# Altium schematic sheet NVME.SchDoc
size C; SheetNumber: 6; SheetTotal: 17
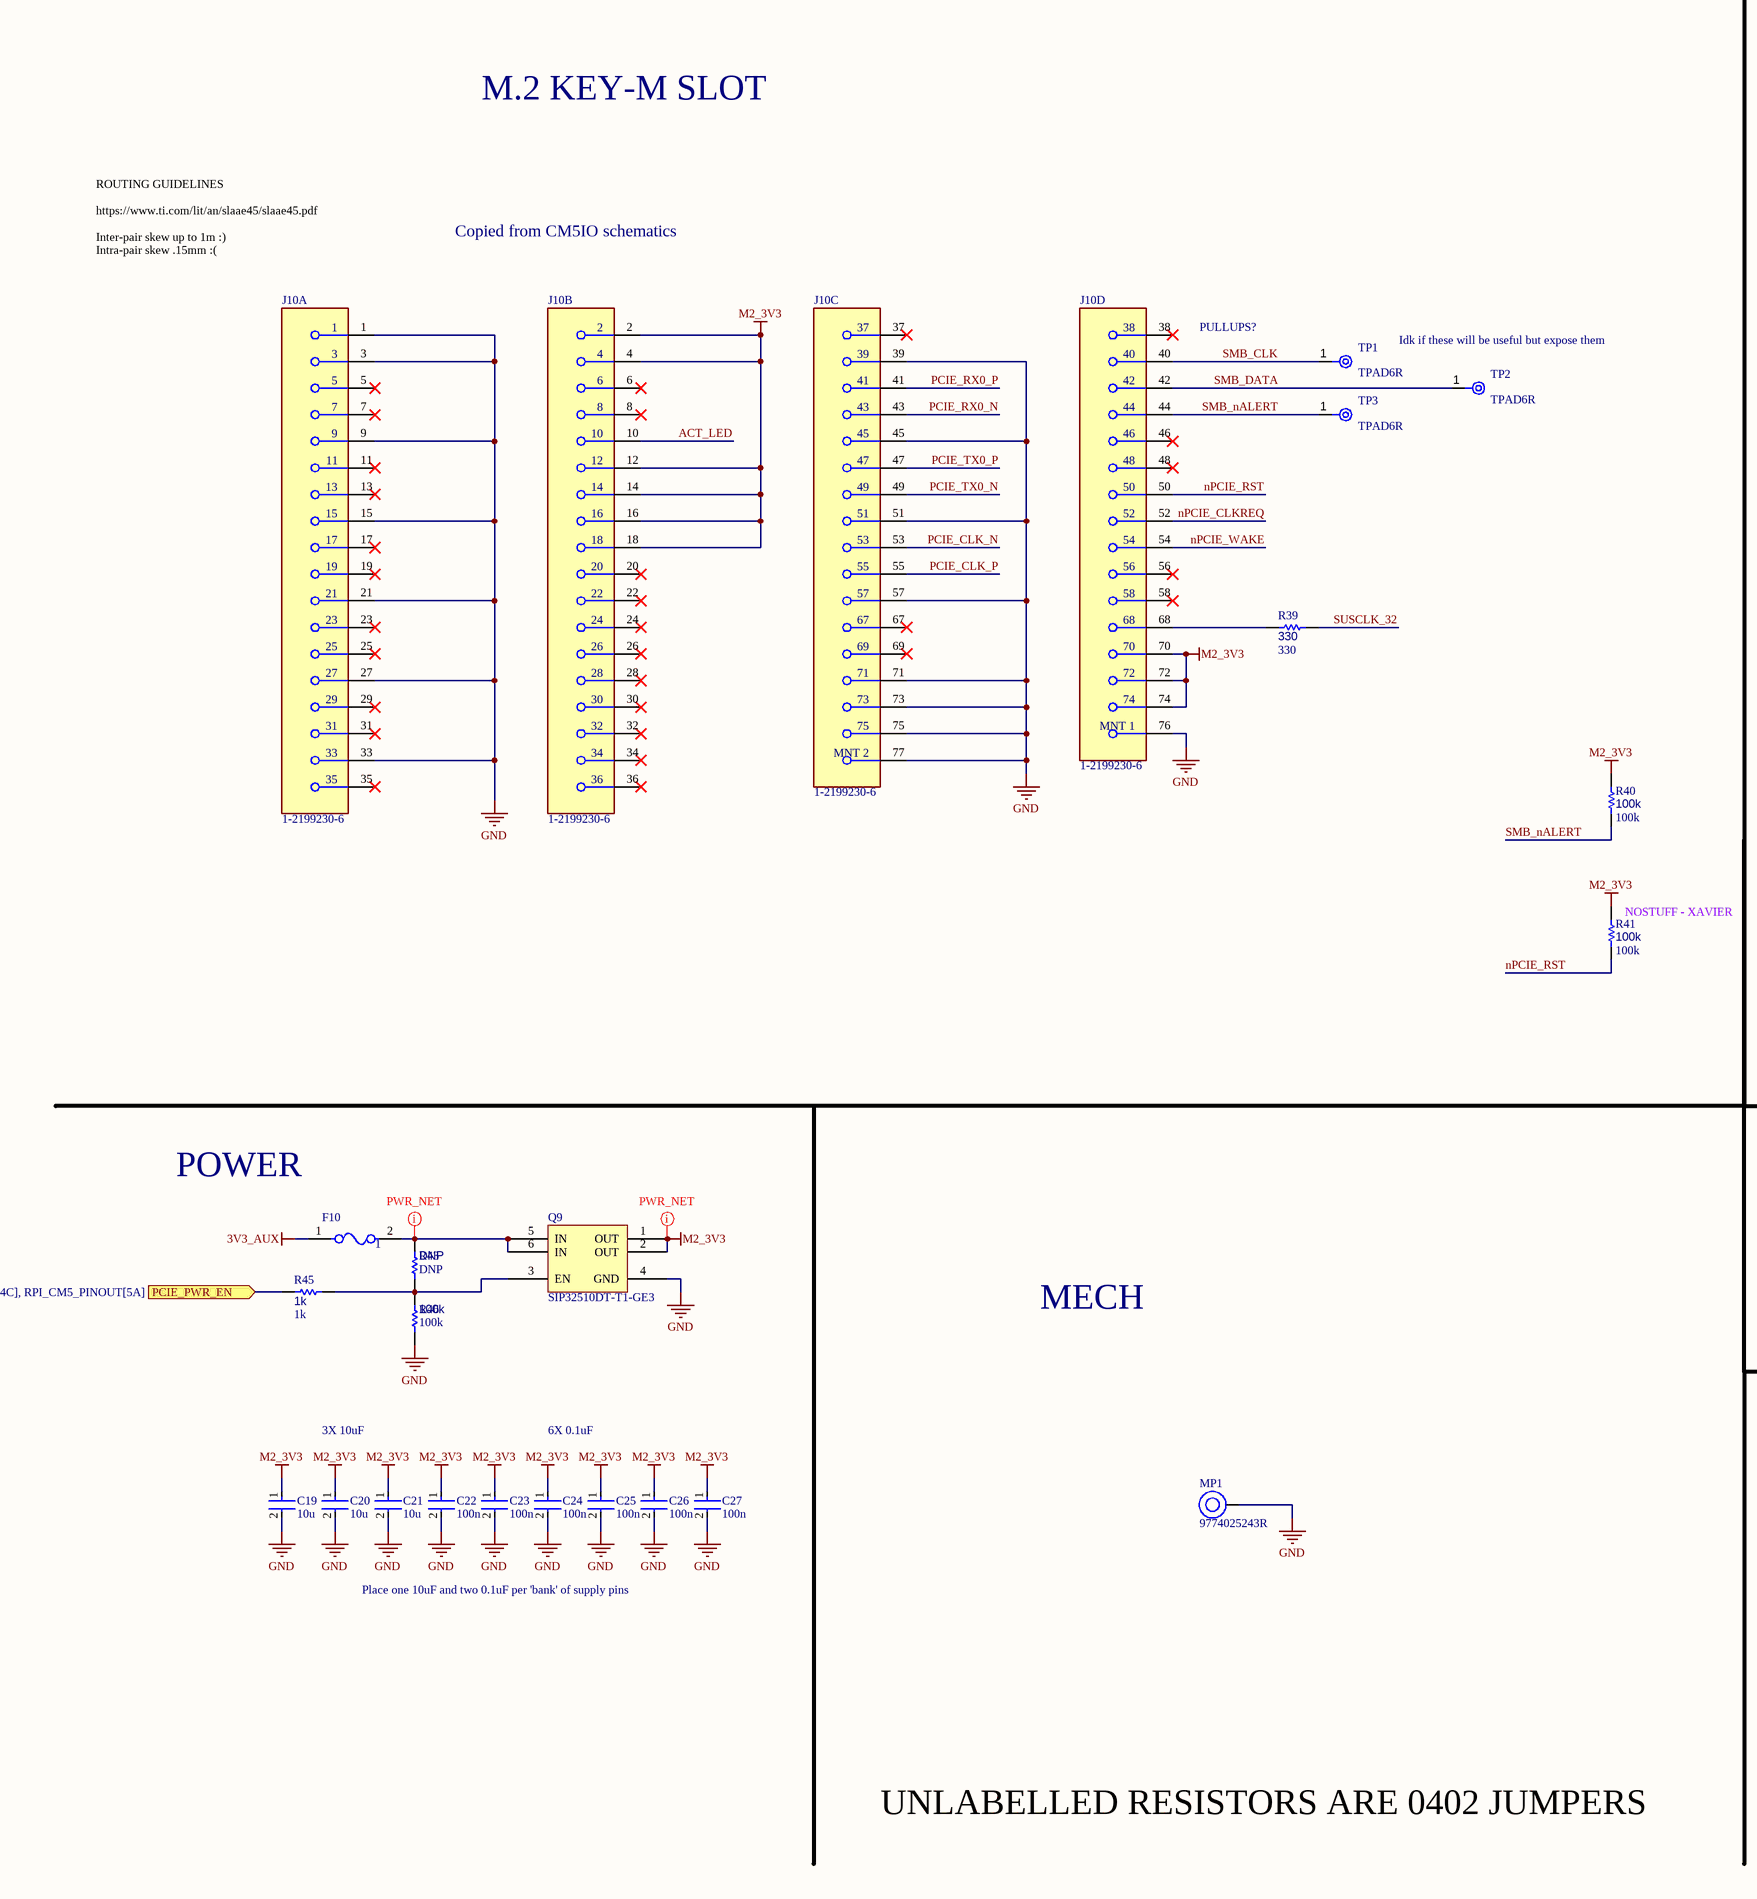
[diagram p0: NVME.SchDoc, left]
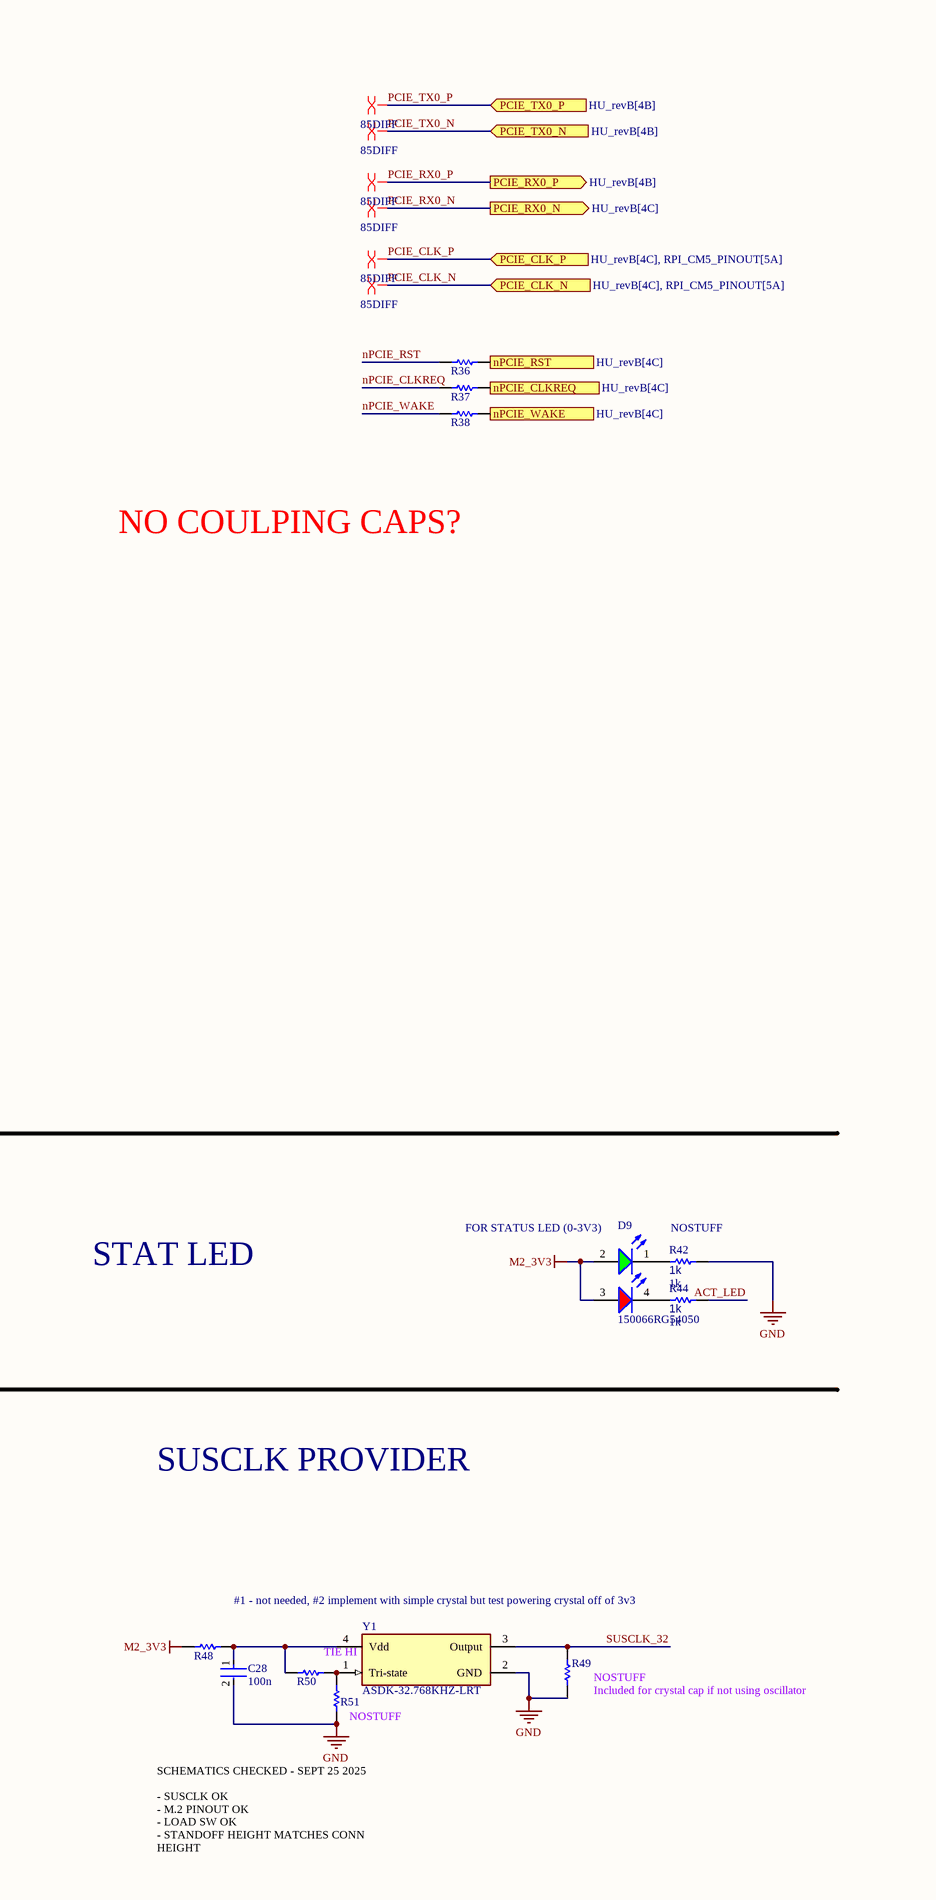
[diagram p1: NVME.SchDoc, right]

## Parts
C19  10u  [FP-0402-L_1_0_0_05-W_0_5-IPC_A]
C20  10u  [FP-0402-L_1_0_0_05-W_0_5-IPC_A]
C21  10u  [FP-0402-L_1_0_0_05-W_0_5-IPC_A]
C22  100n  [FP-0402-L_1_0_0_05-W_0_5-IPC_A]
C23  100n  [FP-0402-L_1_0_0_05-W_0_5-IPC_A]
C24  100n  [FP-0402-L_1_0_0_05-W_0_5-IPC_A]
C25  100n  [FP-0402-L_1_0_0_05-W_0_5-IPC_A]
C26  100n  [FP-0402-L_1_0_0_05-W_0_5-IPC_A]
C27  100n  [FP-0402-L_1_0_0_05-W_0_5-IPC_A]
C28  100n  [FP-0402-L_1_0_0_05-W_0_5-IPC_A]
D9  150066RG54050  [WL-SBCD_0606]
F10  1  [FP-0685T-MFG]
J10  1-2199230-6  [FP-1-2199230-6-MFG]  (parts A,B,C,D of 4)
MP1  9774025243R  [9774025243]
Q9  SIP32510DT-T1-GE3  [SOT95P284X110-6N]
R36  0402 JUMPER  [RESC1005X40X25ML05T05]  (value not drawn)
R37  0402 JUMPER  [RESC1005X40X25ML05T05]  (value not drawn)
R38  0402 JUMPER  [RESC1005X40X25ML05T05]  (value not drawn)
R39  330  [R0603B]
R40  100k  [R0603B]
R41  100k  [R0603B]
R42  1k  [R0603B]
R43  DNP  [R0603B]
R44  1k  [R0603B]
R45  1k  [R0603B]
R46  100k  [R0603B]
R48  0402 JUMPER  [RESC1005X40X25ML05T05]  (value not drawn)
R49  0402 JUMPER  [RESC1005X40X25ML05T05]  (value not drawn)
R50  0402 JUMPER  [RESC1005X40X25ML05T05]  (value not drawn)
R51  0402 JUMPER  [RESC1005X40X25ML05T05]  (value not drawn)
TP1  TPAD6R  [New footprint 1]
TP2  TPAD6R  [New footprint 1]
TP3  TPAD6R  [New footprint 1]
Y1  ASDK-32.768KHZ-LRT  [FP-ASDK-MFG]

## Ports
nPCIE_CLKREQ (out, see HU_revB[4C]), nPCIE_RST (in, see HU_revB[4C]), nPCIE_WAKE (out, see HU_revB[4C]), PCIE_CLK_N (in, see HU_revB[4C], RPI_CM5_PINOUT[5A]), PCIE_CLK_P (in, see HU_revB[4C], RPI_CM5_PINOUT[5A]), PCIE_PWR_EN (in, see HU_revB[4C], RPI_CM5_PINOUT[5A]), PCIE_RX0_N (out, see HU_revB[4C]), PCIE_RX0_P (out, see HU_revB[4B]), PCIE_TX0_N (in, see HU_revB[4B]), PCIE_TX0_P (in, see HU_revB[4B])

## Nets
3V3_AUX: F10.1
GND: C19.2 C20.2 C21.2 C22.2 C23.2 C24.2 C25.2 C26.2 C27.2 C28.2 J10.1 J10.3 J10.9 J10.15 J10.21 J10.27 J10.33 J10.39 J10.45 J10.51 J10.57 J10.71 J10.73 J10.75 J10.76(MNT_1) J10.77(MNT_2) MP1.1 Q9.4(GND) R42.2 R46.1 R49.1 R51.1 Y1.2(GND)
M2_3V3: C19.1 C20.1 C21.1 C22.1 C23.1 C24.1 C25.1 C26.1 C27.1 D9.2(A) D9.3(A) J10.2 J10.4 J10.12 J10.14 J10.16 J10.18 J10.70 J10.72 J10.74 Q9.1(OUT) Q9.2(OUT) R40.1 R41.1 R48.1
ACT_LED: J10.10 R44.2
nPCIE_CLKREQ: J10.52 R37.1
nPCIE_CLKREQ: R37.2 ; port nPCIE_CLKREQ  [a separate net that carries the same name]
nPCIE_RST: J10.50 R36.1 R41.2
nPCIE_RST: R36.2 ; port nPCIE_RST  [a separate net that carries the same name]
nPCIE_WAKE: J10.54 R38.1
nPCIE_WAKE: R38.2 ; port nPCIE_WAKE  [a separate net that carries the same name]
PCIE_CLK_N: J10.53 ; port PCIE_CLK_N
PCIE_CLK_P: J10.55 ; port PCIE_CLK_P
PCIE_PWR_EN: R45.2 ; port PCIE_PWR_EN
PCIE_RX0_N: J10.43 ; port PCIE_RX0_N
PCIE_RX0_P: J10.41 ; port PCIE_RX0_P
PCIE_TX0_N: J10.49 ; port PCIE_TX0_N
PCIE_TX0_P: J10.47 ; port PCIE_TX0_P
SMB_CLK: J10.40 TP1.1(TP)
SMB_DATA: J10.42 TP2.1(TP)
SMB_nALERT: J10.44 R40.2 TP3.1(TP)
SUSCLK_32: R39.1 R49.2 Y1.3(Output)
NetC28_1: C28.1 R48.2 R50.1 Y1.4(Vdd)
NetD9_1: D9.1(K) R42.1
NetD9_4: D9.4(K) R44.1
NetF10_2: F10.2 Q9.5(IN) Q9.6(IN) R43.2
NetJ10_68: J10.68 R39.2
NetQ9_3: Q9.3(EN) R43.1 R45.1 R46.2
NetR50_2: R50.2 R51.2 Y1.1(Tri-state)

Not connected (* = marked no-connect by the designer): J10 5* 6* 7* 8* 11* 13* 17* 19* 20* 22* 23* 24* 25* 26* 28* 29* 30* 31* 32* 34* 35* 36* 37* 38* 46* 48* 56* 58* 67* 69*

## Layout directives
differential pair; differential pair class 85DIFF: PCIE_CLK_N, PCIE_CLK_P, PCIE_RX0_N, PCIE_RX0_P, PCIE_TX0_N, PCIE_TX0_P
net class PWR: M2_3V3, NetF10_2

## Notes on the sheet
- M.2 KEY-M SLOT
- ROUTING GUIDELINES
  https://www.ti.com/lit/an/slaae45/slaae45.pdf
  Inter-pair skew up to 1m :)
  Intra-pair skew .15mm :(
- Copied from CM5IO schematics
- PULLUPS?
- (near TP2) Idk if these will be useful but expose them
- NO COULPING CAPS?
- (near R41) NOSTUFF - XAVIER
- POWER
- STAT LED
- (near D9) FOR STATUS LED (0-3V3)
- (near R42) NOSTUFF
- MECH
- 3X 10uF
- 6X 0.1uF
- SUSCLK PROVIDER
- Place one 10uF and two 0.1uF per 'bank' of supply pins
- #1 - not needed, #2 implement with simple crystal but test powering crystal off of 3v3
- (near Y1) TIE HI
- (near R51) NOSTUFF
- (near R49) NOSTUFF
- (near R49) Included for crystal cap if not using oscillator
- UNLABELLED RESISTORS ARE 0402 JUMPERS
- SCHEMATICS CHECKED - SEPT 25 2025
  - SUSCLK OK
  - M.2 PINOUT OK
  - LOAD SW OK
  - STANDOFF HEIGHT MATCHES CONN HEIGHT

## Library data of the parts
C19-C28 = CMP-001-00058-1: LARGE PADS, 0402 CAP, CHANGE COMMENT TO MATCH REAL P/N; Capacitor Type: Ceramic; Min Operating Temperature: -55°C; Mounting Technology: Surface Mount; Pins: 2; Case/Package: 0402; RoHS Compliant: Yes; Max Operating Temperature: 85°C
D9 = CMP-004-00040-2: Led, Red/Grn, 180Mcd/230Mcd, 624Nm/525Nm Rohs Compliant: Yes; Source: rgled.SchLib; Component Type: Standard; Pins: 4; Design Item ID: CMP-004-00034-2
F10 = CMP-16042-000006-1: FUSE BOARD MNT 5A 63VAC/VDC 1206; RoHS Compliant: Yes
J10 = CMP-03365-000001-1: CONN EDGE DUAL FMALE 67POS 0.020; Manufacturer: TE; Number Of Contacts: 67; Current Rating: 0.5A; Pitch: 0.5mm; Conn Gender: Female; Is Female: yes; Voltage Rating: 50V; Conn Orientation: Right Angle; Automotive: No; Temperature Range High: +80°C; Package: 1-2199230-6; Category: Conn; Temperature: -40°C to +80°C; Number Of Rows: 2; ComponentLink2URL: http://www.te.com/commerce/DocumentDelivery/DDEController?Action=showdoc&DocId=Specification+Or+Standard%7F114-115006%7FB%7Fpdf%7FEnglish%7FENG_SS_114-115006_B_114-115006_REV_B.pdf%7F1-2199230-6; Manufacturer Part Number: 1-2199230-6; Height: 4.2mm; RoHS: TRUE; Footprint Url: http://www.te.com/commerce/DocumentDelivery/DDEController?Action=showdoc&DocId=Customer+Drawing%7F2199230%7FB2%7Fpdf%7FEnglish%7FENG_CD_2199230_B2.pdf%7F1-2199230-6; Digikey Description: CONN EDGE DUAL FMALE 67POS 0.020; Device Class L2: Card Edge Connectors; Contact Material: Gold,Tin; Device Class L1: Connectors; Device Class L3: unset; ComponentLink2Description: Datasheet; Temperature Range Low: -40°C; Octopart: https://octopart.com/1-2199230-6-te+connectivity-34969376; Lead Free: Yes
MP1 = CMP-03913-59774857-1: 9774025243R Spacer Material: Steel, Tin-Plated Mounting: SMT Series: WA-SMST Thread D: M2; Outside Diameter: 4.3434mm; Threaded/Unthreaded: Threaded; Plating: Tin; REACH SVHC: Unknown; NexarPartId: 59774857; RoHS: Compliant; Material: Steel; Packaging: Tape and Reel; Max Operating Temperature: 150°C; Min Operating Temperature: -55°C; Length: 2.5mm; Height: 2.5mm
Q9 = CMP-019-00054-1: Power Switch ICs – Power Distribution; VISHAY; SIP32510DT-T1-GE3; 1; 1; 5.5 V; SOT-23-6; Max Supply Voltage: 5.5V; Max Power Dissipation: 833mW; Min Supply Voltage: 1.2V; Case/Package: SOT-23-6; Mounting Technology: Surface Mount; Max Operating Temperature: 85°C; Min Operating Temperature: -40°C
R36-R38 R48-R51 = CMP-009-00118-2: READ THE NAME; Pins: 2; Component Type: Standard; Design Item ID: CMP-009-00206-2; Source: 0402jump.SchLib
R39-R46 = CMP-009-00002-14: Resistor
  R39: Value: 330
  R40 R41 R46: Value: 100k
  R42 R44 R45: Value: 1k
  R43: Value: DNP
TP1-TP3 = CMP-00025-2: Test Point .6mm
Y1 = CMP-27762-001115-1: XTAL OSC XO 32.7680KHZ CMOS SMD; Load Capacitance: 15pF; Max Supply Current: 3.5mA; Min Supply Voltage: 2.97V; Operating Supply Voltage: 3.3V; Frequency Stability: 25ppm; Lead Free: Lead Free; Case/Package: CSMD; Number of Pins: 4; Max Operating Temperature: 85°C; Packaging: Tape and Reel; Width: 0.079inch; Min Operating Temperature: -40°C; Radiation Hardening: No; Length: 2.5mm; Depth: 2mm; Termination: SMD/SMT; Height: 0.037inch; Series: ASDK; Frequency: 32.768kHz; Mount: Surface Mount